# Altium schematic sheet REUN.468349.001_PSU_Board_3V3_Logic.SchDoc
size 420 x 297 mm; DocumentNumber: РЕУН.468349.001 Э3 2D; SheetNumber: 5; Format: A3
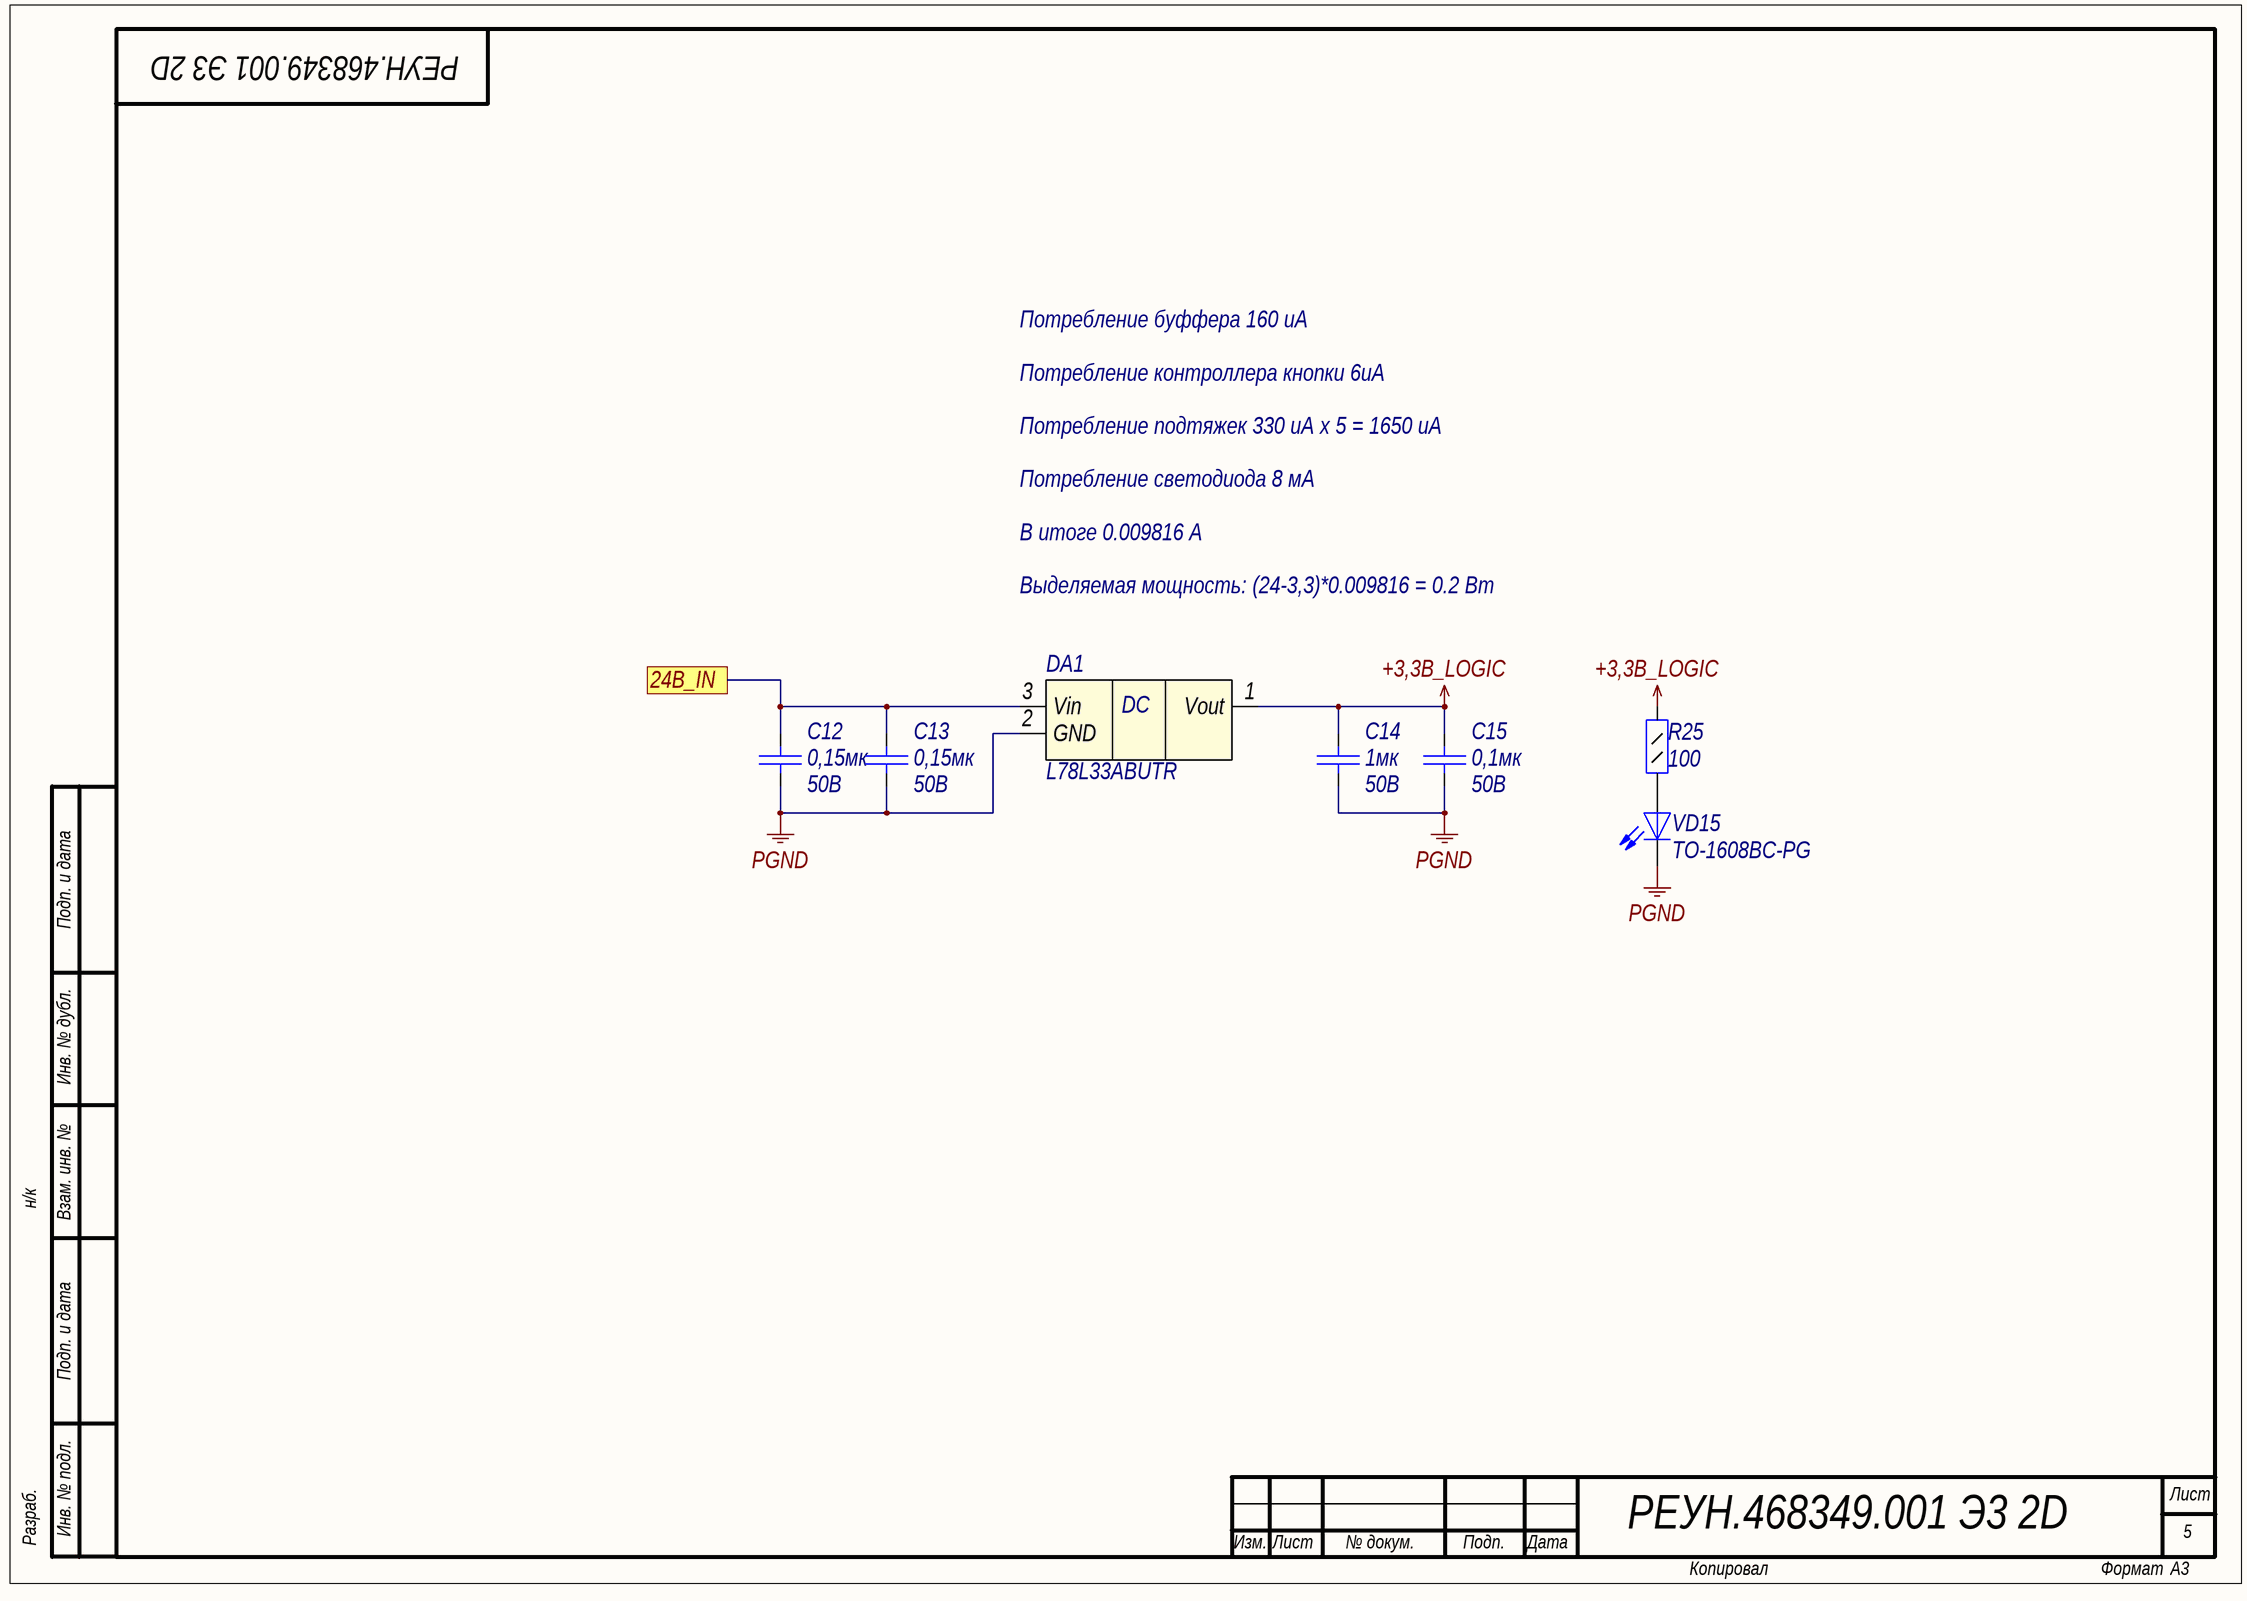
[diagram p0: REUN.468349.001_PSU_Board_3V3_Logic.SchDoc]

## Parts
C12  Voltage: 50B  [C0805]  (hidden comment: 0,15мк)
C13  Voltage: 50B  [C0805]  (hidden comment: 0,15мк)
C14  Voltage: 50B  [C0805]  (hidden comment: 1мк)
C15  Voltage: 50B  [C0805]  (hidden comment: 0,1мк)
DA1  L78L33ABUTR  [SOT-89-3]
R25  value 100  [R0805]  (hidden comment: Resistor_0,125Вт)
VD15  TO-1608BC-PG  [L_0603_GREEN]

## Ports
24B_IN

## Nets
+3,3B_LOGIC: C14.2 C15.2 DA1.1(Vout) R25.2
PGND: C12.2 C13.2 C14.1 C15.1 DA1.2(GND) VD15.1(K)
24B_IN: C12.1 C13.1 DA1.3(Vin) ; port 24B_IN
NetR25_1: R25.1 VD15.2(A)

## Notes on the sheet
- Потребление буффера 160 uA
- Потребление контроллера кнопки 6uA
- Потребление подтяжек 330 uA x 5 = 1650 uA
- Потребление cветодиода 8 мА
- В итоге 0.009816 А
- Выделяемая мощность: (24-3,3)*0.009816 = 0.2 Вт
- Подп. и дата
- Инв. № дубл.
- н/к
- Взам. инв. №
- Разраб.
- Инв. № подл.
- Лист
- Изм.
- № докум.
- Подп.
- Дата
- Копировал
- Формат
- (in symbol pwr180) DC

## Library data of the parts
C12 C13 = cap142: Конденсатор; Part Name: Ceramic; Manufacture: Murata; Part Number: GRM21BR71H154K; id: cap142; TKE: X7R; Value: 0,15мк
C14 = cap151: Конденсатор; Part Name: Ceramic; Manufacture: Murata; Part Number: GRM21BR71H105KA12L; id: cap151; TKE: X7R; Value: 1мк
C15 = cap141: Конденсатор; Part Name: Ceramic; Manufacture: Murata; Part Number: GRM21BR71H104KA01K; id: cap141; TKE: X7R; Value: 0,1мк
DA1 = pwr180: Cтабилизатор напряжения (+3,3В; 0.1А), 4%, (-40...+125C); Part Name: Positive voltage regulators; Manufacturer: ST Microelectronics; id: pwr180; Input Voltage: 30B; Output Voltage: 3,3B; Dropout Voltage: 2V; Current: 100mA; Quiescent current: 6mA; Type: Linear; Part Number: L78L33ABUTR
R25 = res49: Резистор; Manufacture: Yageo; Part Number: RC0805FR-07100RL; id: res49; Accuracy: 0.01; Part Name: Resistor; Power: 0,125Вт
VD15 = diode43: Светодиод; Part Name: LED green 0603; Manufacture: OASISTEK; id: diode43; Part Number: TO-1608BC-PG